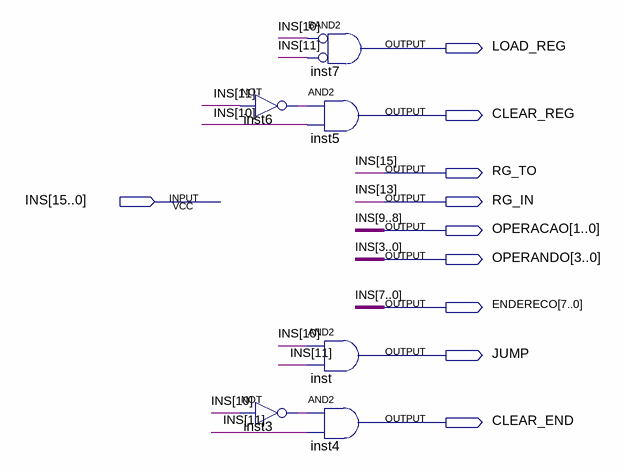
[diagram p0: schematic sheet]
// Quartus schematic UC.bdf as structural Verilog: 6 symbols, 10 pins
module UC (
  input  [15:0] INS,
  output LOAD_REG,
  output CLEAR_REG,
  output RG_TO,
  output RG_IN,
  output [1:0] OPERACAO,
  output [3:0] OPERANDO,
  output [7:0] ENDERECO,
  output JUMP,
  output CLEAR_END
);

  wire inst3_out, inst6_out;

  not inst6 (inst6_out, INS[11]);
  not inst3 (inst3_out, INS[10]);
  and inst7 (LOAD_REG, ~INS[10], ~INS[11]);  // BAND2
  and inst5 (CLEAR_REG, inst6_out, INS[10]);
  and inst (JUMP, INS[10], INS[11]);
  and inst4 (CLEAR_END, inst3_out, INS[11]);

  assign ENDERECO = INS[7:0];
  assign OPERACAO = INS[9:8];
  assign OPERANDO = INS[3:0];
  assign RG_IN = INS[13];
  assign RG_TO = INS[15];
endmodule
